# EAGLE design 1tm32_test (EAGLE 9.6.2)
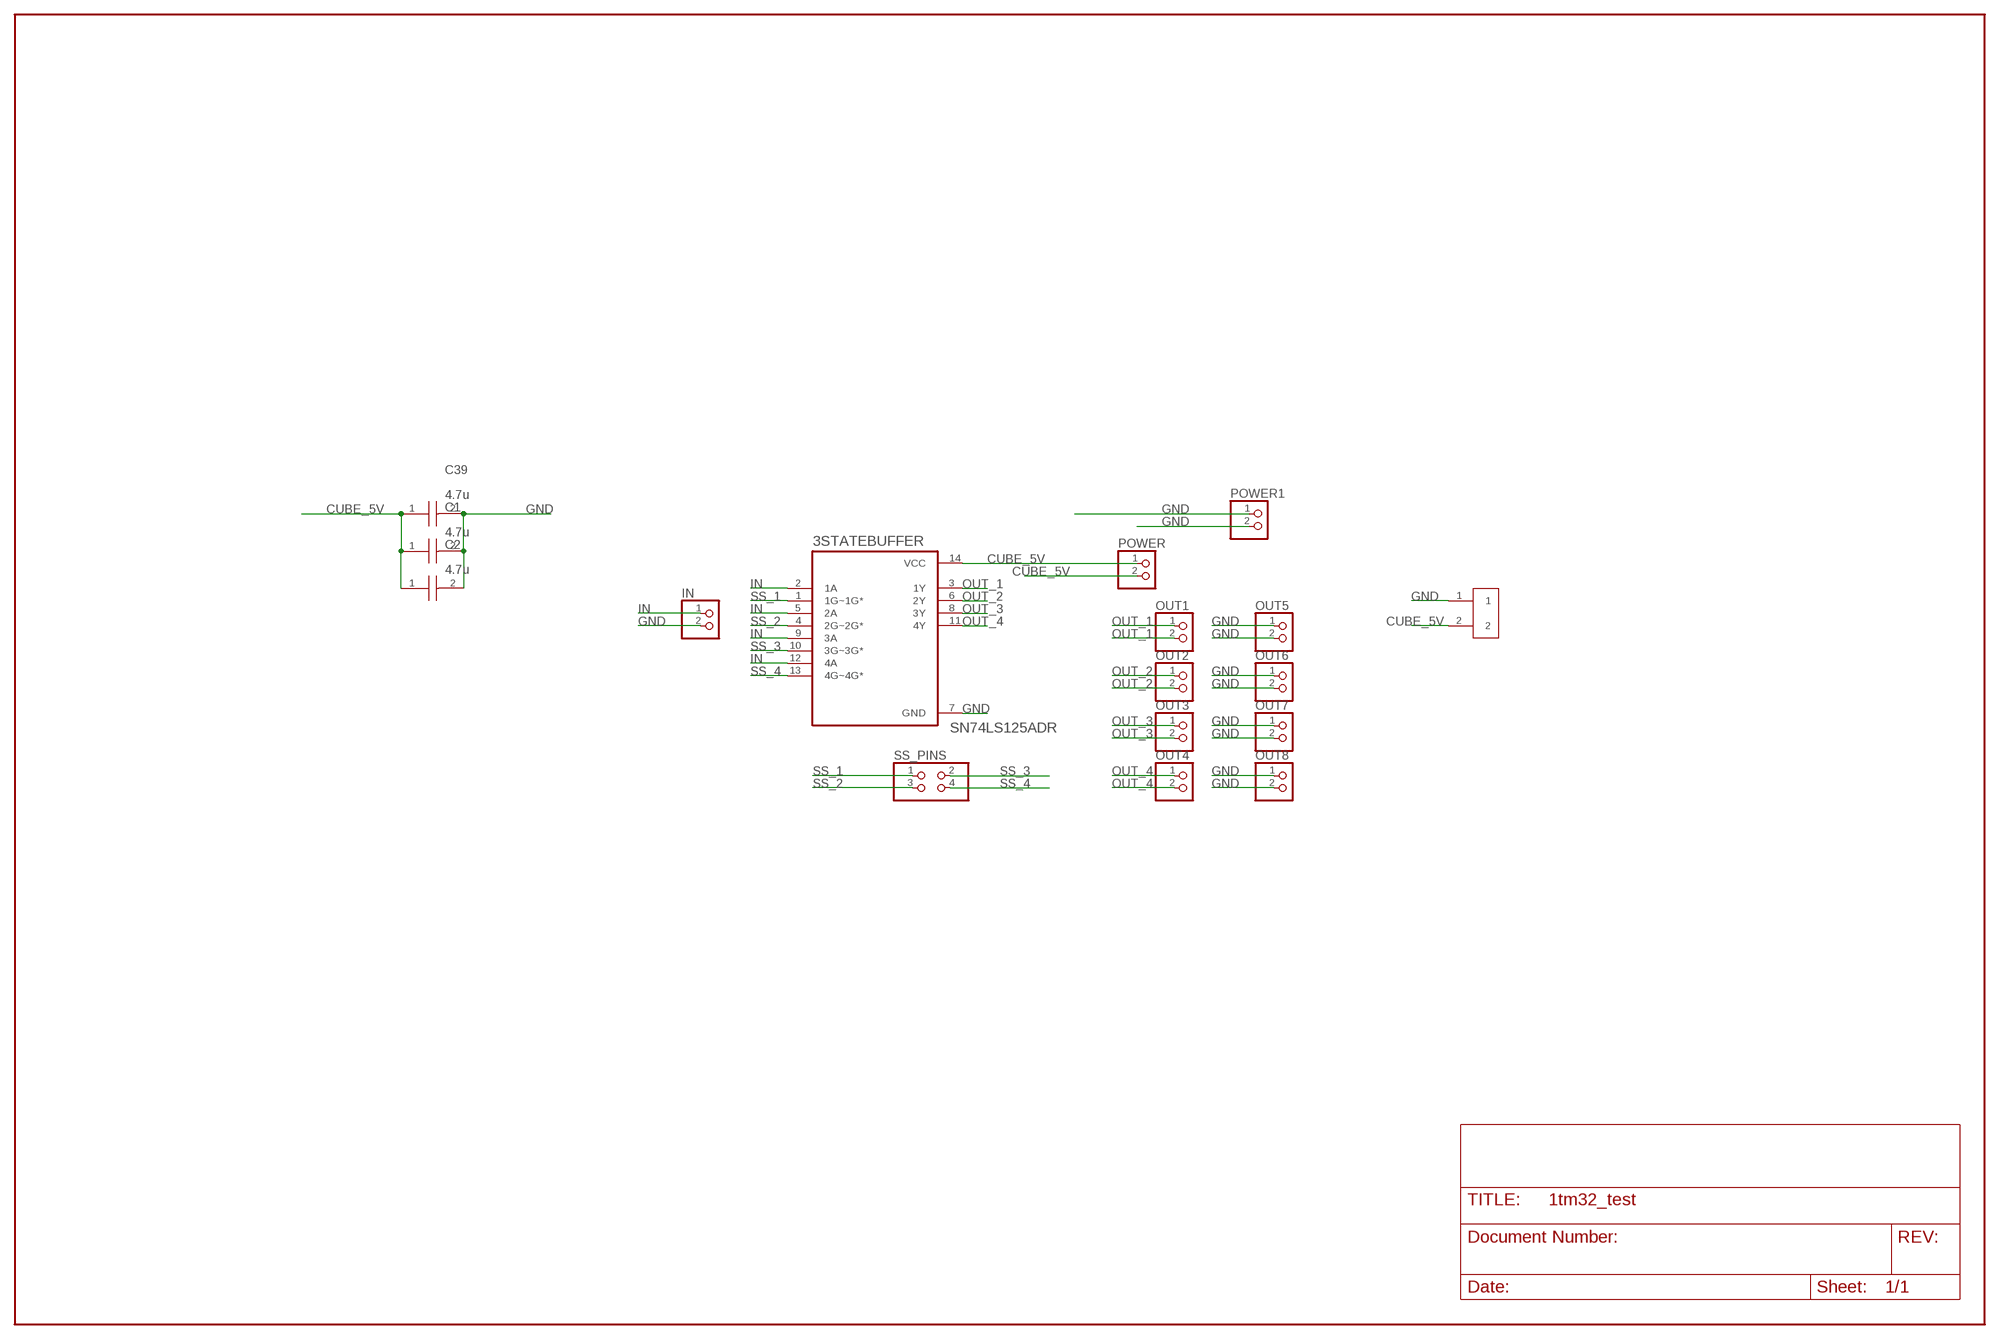
[diagram p0: schematic, sheet 1]

## Parts
3STATEBUFFER  SN74LS125ADR  [SOIC127P600X175-14N]
C1  4.7u  GRT21BC71H475KE13L  [CAPC2012X145N]
C2  4.7u  GRT21BC71H475KE13L  [CAPC2012X145N]
C39  4.7u  GRT21BC71H475KE13L  [CAPC2012X145N]
IN  PINHD-1X2  [1X02]
J1  1935161  [PHOENIX_1935161]
OUT1  PINHD-1X2  [1X02]
OUT2  PINHD-1X2  [1X02]
OUT3  PINHD-1X2  [1X02]
OUT4  PINHD-1X2  [1X02]
OUT5  PINHD-1X2  [1X02]
OUT6  PINHD-1X2  [1X02]
OUT7  PINHD-1X2  [1X02]
OUT8  PINHD-1X2  [1X02]
POWER  PINHD-1X2  [1X02]
POWER1  PINHD-1X2  [1X02]
SS_PINS  PINHD-2X2  [2X02]

## Nets
CUBE_5V: 3STATEBUFFER.14(VCC) C1.1 C2.1 C39.1 J1.2 POWER.1 POWER.2
GND: 3STATEBUFFER.7(GND) C1.2 C2.2 C39.2 IN.2 J1.1 OUT5.1 OUT5.2 OUT6.1 OUT6.2 OUT7.1 OUT7.2 OUT8.1 OUT8.2 POWER1.1 POWER1.2
IN: 3STATEBUFFER.2(1A) 3STATEBUFFER.5(2A) 3STATEBUFFER.9(3A) 3STATEBUFFER.12(4A) IN.1
OUT_1: 3STATEBUFFER.3(1Y) OUT1.1 OUT1.2
OUT_2: 3STATEBUFFER.6(2Y) OUT2.1 OUT2.2
OUT_3: 3STATEBUFFER.8(3Y) OUT3.1 OUT3.2
OUT_4: 3STATEBUFFER.11(4Y) OUT4.1 OUT4.2
SS_1: 3STATEBUFFER.1(1G~1G*) SS_PINS.1
SS_2: 3STATEBUFFER.4(2G~2G*) SS_PINS.3
SS_3: 3STATEBUFFER.10(3G~3G*) SS_PINS.2
SS_4: 3STATEBUFFER.13(4G~4G*) SS_PINS.4

## Library data of the parts
3STATEBUFFER = SN74LS125ADR:SN74LS125ADR: Check availability <https://pricing.snapeda.com/parts/SN74LS125ADR/Texas%20Instruments/view-part?ref=eda>; AVAILABILITY: In Stock; DESCRIPTION: 4-ch, 4.75-V to 5.25-V bipolar buffers with 3-state outputs; MF: Texas Instruments; MP: SN74LS125ADR; PACKAGE: SOIC-14 Texas Instruments; PRICE: None; PURCHASE-URL: https://pricing.snapeda.com/search/part/SN74LS125ADR/?ref=eda
C1 C2 C39 = GRT21BC71H475KE13L(4_7u):GRT21BC71H475KE13L: GRT21BC71H475KE13_ (0805, X7S:EIA, 4.7uF, DC50V) Source: Datasheet <https://search.murata.co.jp/Ceramy/image/img/A01X/G101/ENG/GRT21BC71H475KE13-01.pdf>; DESCRIPTION: GRT21BC71H475KE13_ (0805, X7S:EIA, 4.7uF, DC50V); HEIGHT: 1.45mm; MANUFACTURER_NAME: Murata Electronics; MANUFACTURER_PART_NUMBER: GRT21BC71H475KE13L; MOUSER_PART_NUMBER: 81-GRT21BC71H475KE3L; MOUSER_PRICE-STOCK: https://www.mouser.co.uk/ProductDetail/Murata-Electronics/GRT21BC71H475KE13L?qs=rI7uf1IzohQrtwc9u30k7A%3D%3D
IN OUT1-OUT8 POWER POWER1 = pinhead:PINHD-1X2: PIN HEADER
J1 = 1935161:1935161: Conn Terminal Blocks 2 POS 5mm Solder ST Thru-Hole 16A Check availability <https://pricing.snapeda.com/parts/1935161/Phoenix%20Contact/view-part?ref=eda>; AVAILABILITY: In Stock; DESCRIPTION: 2 Position Wire to Board Terminal Block Horizontal with Board 0.197 (5.00mm) Through Hole; MF: Phoenix Contact; MP: 1935161; PACKAGE: None; PRICE: None; PURCHASE-URL: https://pricing.snapeda.com/search/part/1935161/?ref=eda
SS_PINS = pinhead:PINHD-2X2: PIN HEADER

## Board
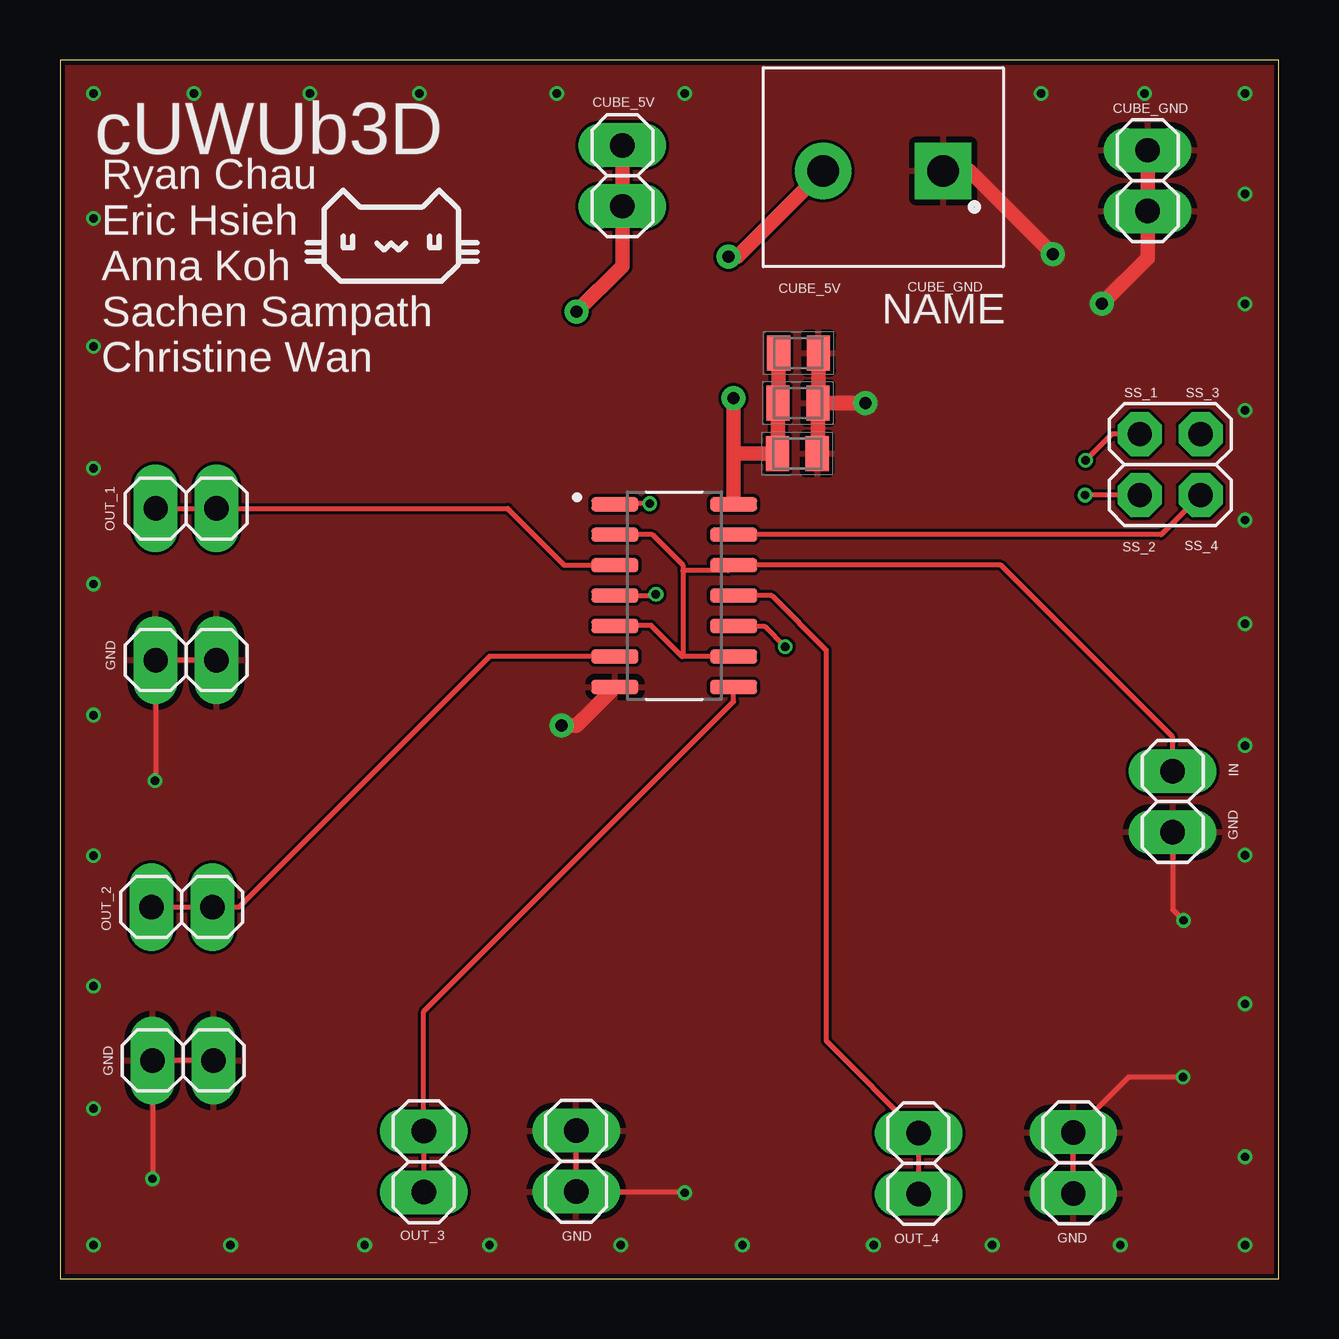
[diagram p1: board, top side]
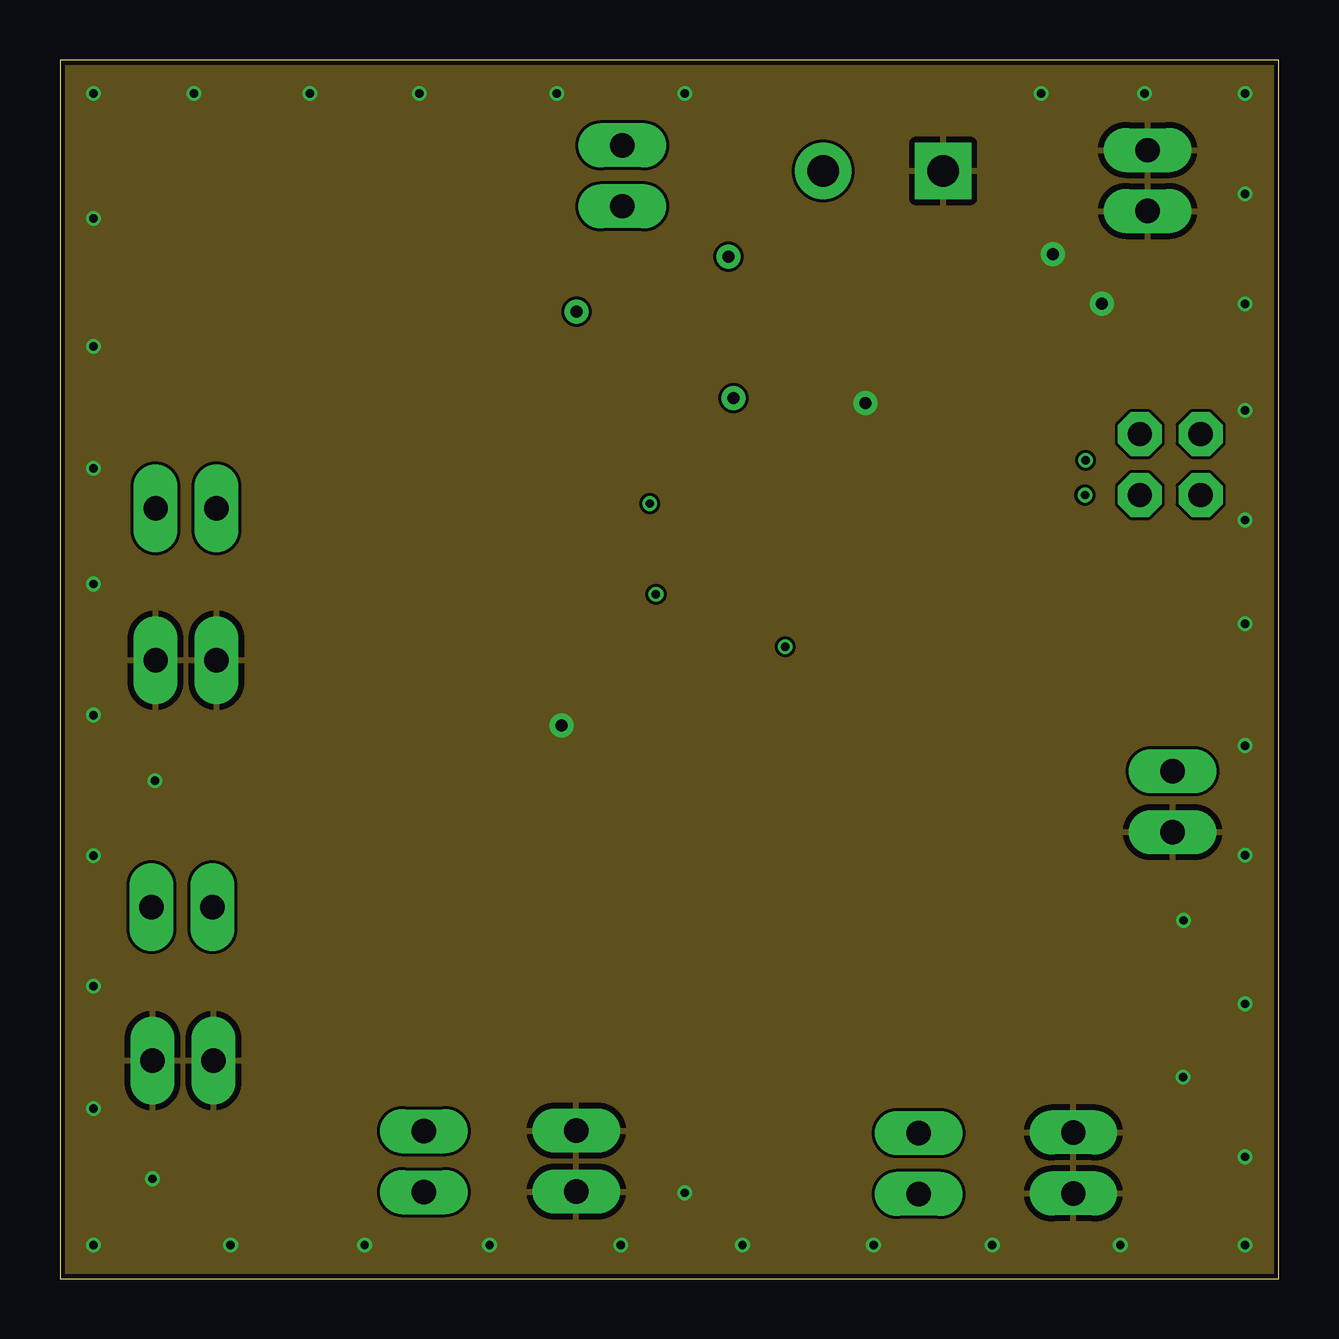
[diagram p2: board, inner layer Route2]
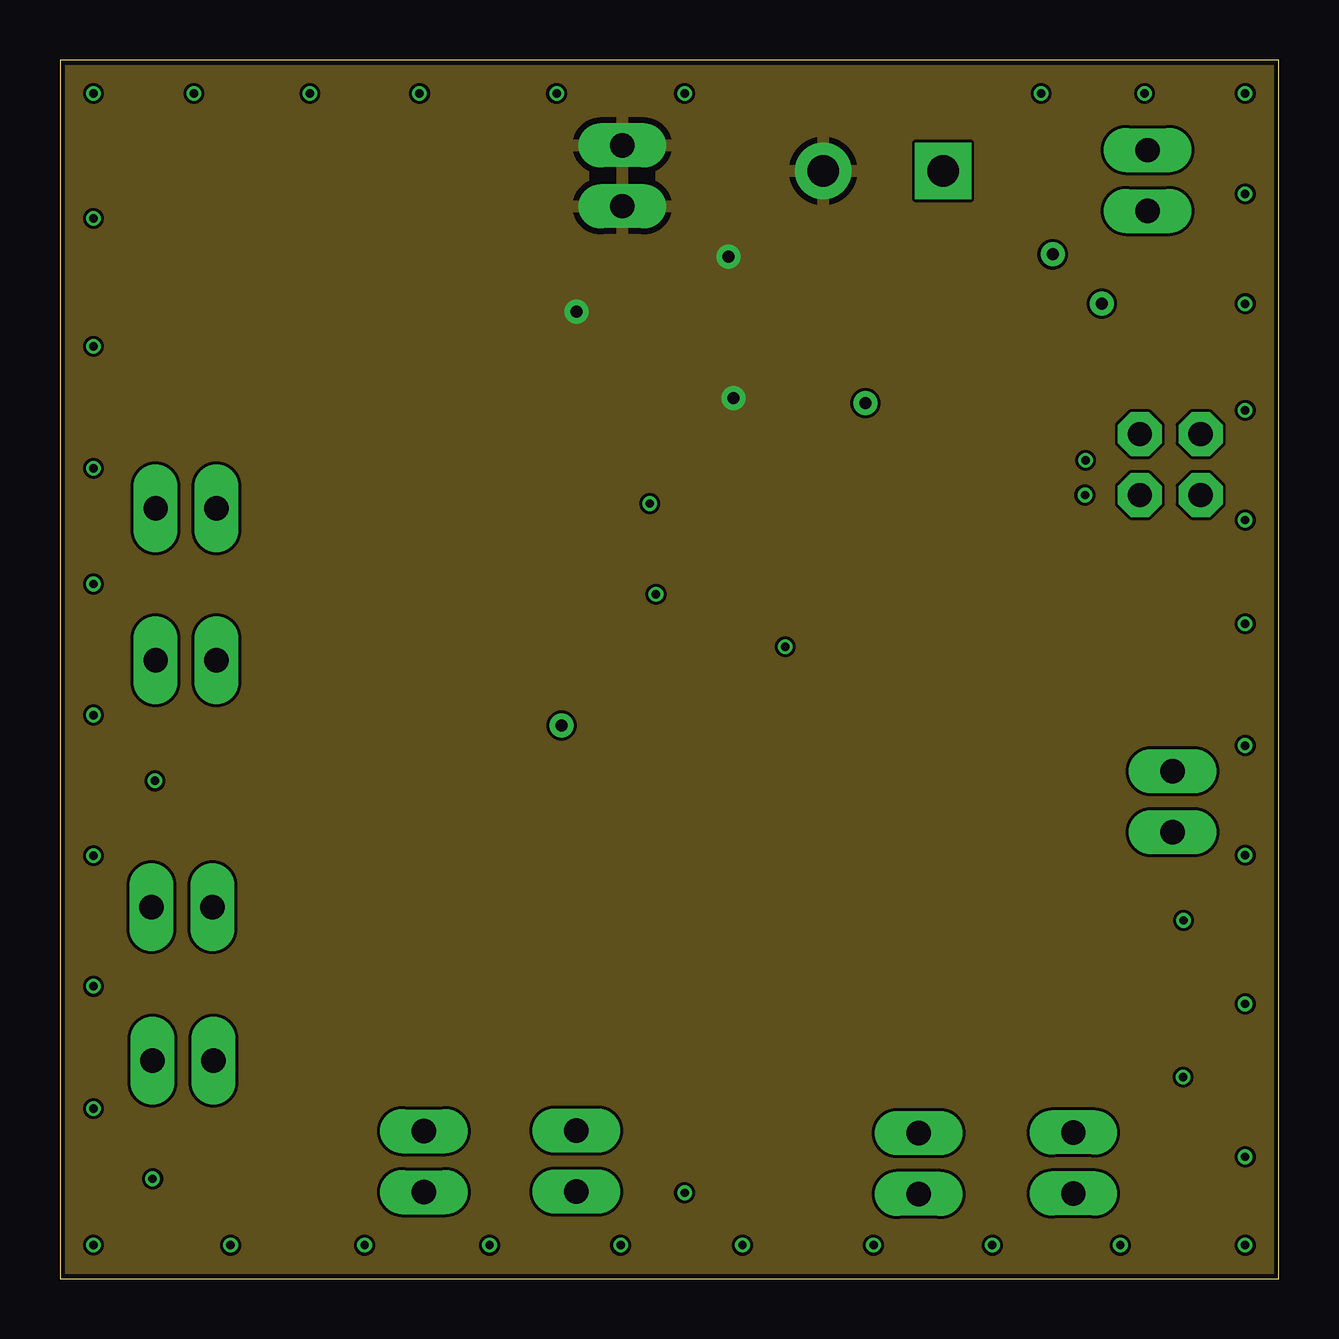
[diagram p3: board, inner layer Route15]
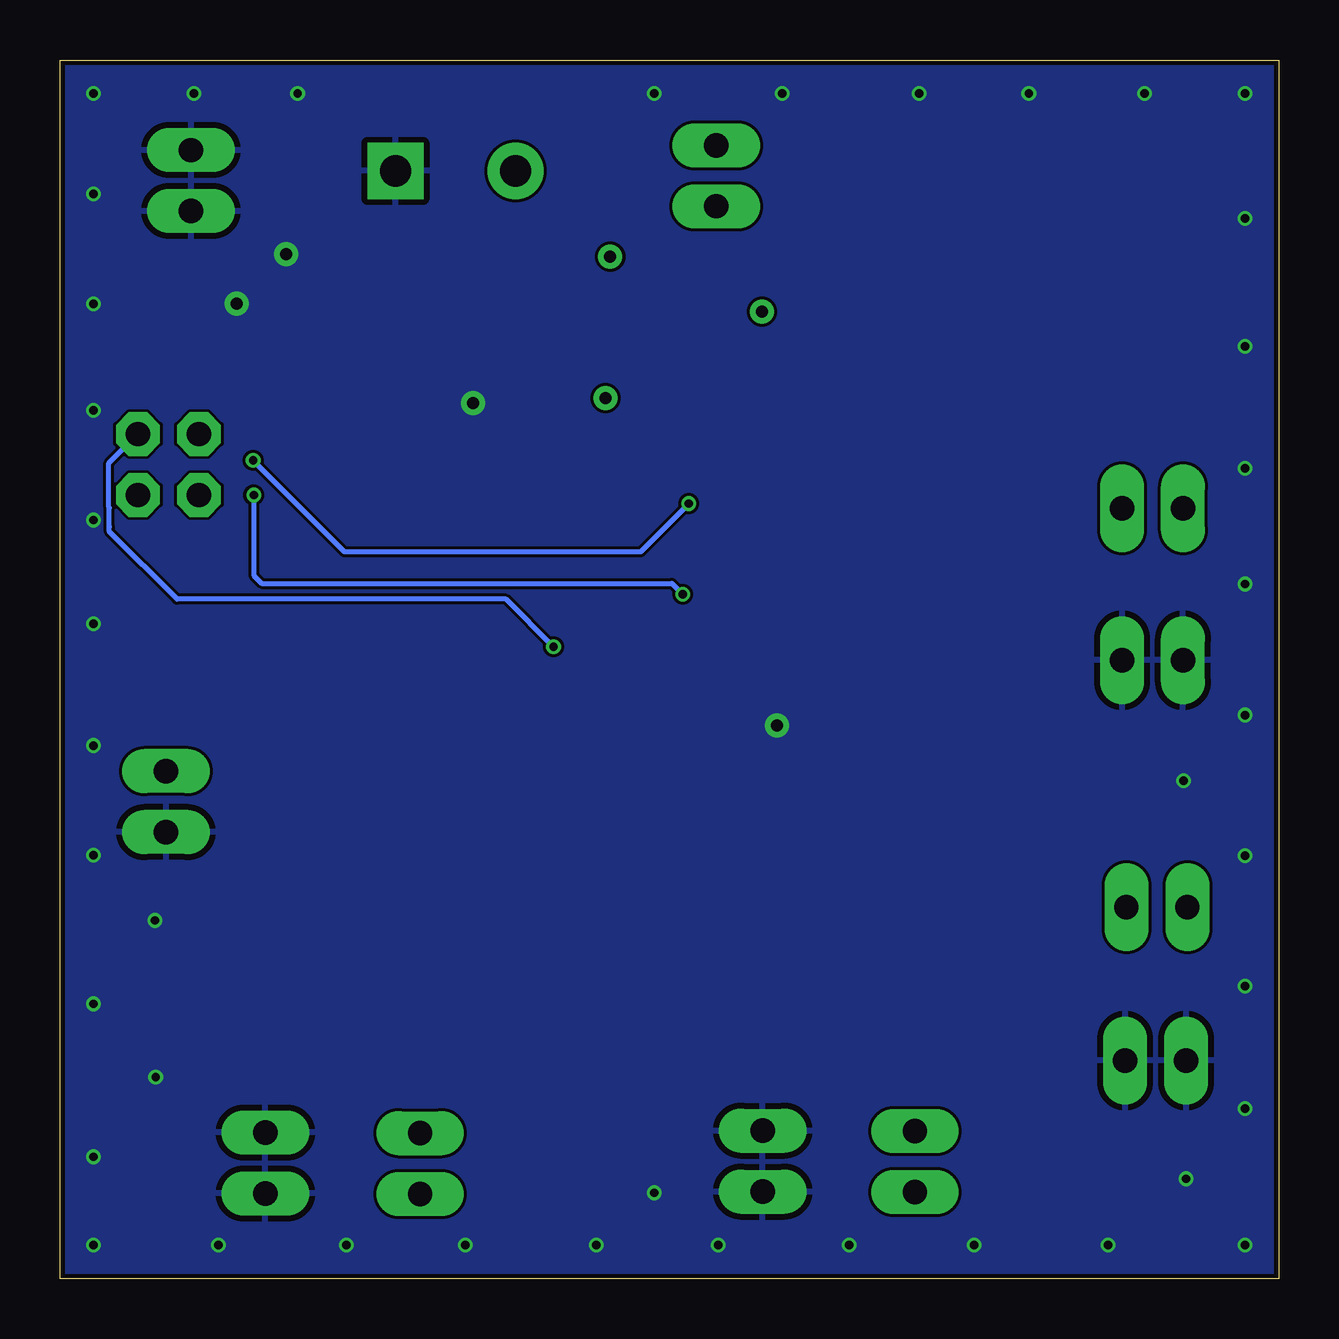
[diagram p4: board, bottom side, seen from below]

Size 50.8 x 50.8 mm. Coordinates in mm from the lower left corner, seen from the top.
Outline: 0,0 50.8,0 50.8,50.8 0,50.8 0,0
Copper layers (1+2*15+16): Top 0.035mm / dielectric 0.2mm / Route2 0.0175mm / dielectric 1.065mm / Route15 0.0175mm / dielectric 0.2mm / Bottom 0.035mm
Design rules "jlcpcb-4layers": minimum track width 3.5mil, minimum drill 0.2mm, track to track 5mil, track to pad 0.2mm, pad to pad 5mil, via to via 0.5mm, smd to smd 5mil, copper to edge 0.2mm, drill to drill 6mil, minimum pad ring 10mil, minimum via ring 0.13mm, stop-mask expansion 0.05mm, vias tented up to drill 16mil, thermal gap 10mil

### Footprints (pad centres in the part's own frame; a part is rotated, then mirrored left to right if it is on the bottom)
SOIC127P600X175-14N = smd 1.97 x 0.6: 1 -2.475,3.81; 2 -2.475,2.54; 3 -2.475,1.27; 4 -2.475,0; 5 -2.475,-1.27; 6 -2.475,-2.54; 7 -2.475,-3.81; 8 2.475,-3.81; 9 2.475,-2.54; 10 2.475,-1.27; 11 2.475,0; 12 2.475,1.27; 13 2.475,2.54; 14 2.475,3.81
CAPC2012X145N = smd 0.97 x 1.47: 1 -0.83,0; 2 0.83,0
1X02 = drill 1.016 long: 1 -1.27,0; 2 1.27,0
PHOENIX_1935161 = drill 1.3 square: 1 -2.5,0 | drill 1.3: 2 2.5,0
2X02 = drill 1.016 octagon: 1 -1.27,-1.27; 2 -1.27,1.27; 3 1.27,-1.27; 4 1.27,1.27

### Placement (x,y rotation side)
3STATEBUFFER  25.6,28.47 0 top
C1  30.76,36.5 0 top
C2  30.78,38.58 0 top
C39  30.73,34.39 0 top
IN  46.38,19.89 270 top
J1  34.32,46.18 180 top
OUT1  5.26,32.11 0 top
OUT2  5.08,15.49 180 top
OUT3  15.16,4.88 270 top
OUT4  35.79,4.8 90 top
OUT5  5.26,25.78 0 top
OUT6  5.13,9.09 0 top
OUT7  21.51,4.9 90 top
OUT8  42.24,4.83 90 top
POWER  23.44,45.97 90 top
POWER1  45.34,45.77 270 top
SS_PINS  46.28,33.93 270 top

### Tracks (layer width: path | path; a pad name or v marks a point on that pad's centre or on a via)
CUBE_5V  (via drill 0.5 pad 1)
  Top 0.61: POWER.2 POWER.1 23.44,42.22 v21.54,40.31 | v28.07,36.7 v28.08,36.69 28.08,34.39 | 28.08,34.39 3STATEBUFFER.14 | C2.1 29.95,36.52 C1.1 29.93,34.42 C39.1 28.08,34.39 | J1.2 28.23,42.6 v27.86,42.6
  pour Route15: -0.1,50.72 50.85,50.72 50.85,0.08 50.88,0.05 0.05,0.05 -0.05,-0.05 -0.05,50.67
GND  (via drill 0.35, 0.5 pad 1)
  Top 0.203: IN.2 46.38,15.39 v46.84,14.94 | OUT5.2 OUT5.1 3.99,20.78 v3.96,20.75 | OUT6.2 OUT6.1 v3.86,4.17 | OUT7.2 OUT7.1 25.98,3.63 v26.04,3.58 | OUT8.1 OUT8.2 44.55,8.41 v46.81,8.41
  Top 0.61: POWER1.1 POWER1.2 45.34,42.55 v43.43,40.64 | C2.2 31.61,36.52 C1.2 | C1.2 31.59,34.42 C39.2 | C1.2 v33.58,36.5 | 3STATEBUFFER.7 21.53,23.06 v20.9,23.06 | J1.1 37.9,46.18 v41.38,42.7
  other vias: 1.4,1.4 7.11,1.4 12.7,1.4 17.91,1.4 23.37,1.4 28.45,1.4 33.91,1.4 38.86,1.4 44.2,1.4 49.4,1.4 49.4,5.08 49.4,17.65 49.4,22.23 49.4,27.3 49.4,31.62 49.4,36.2 49.4,40.64 49.4,45.21 49.4,49.4 45.21,49.4 40.89,49.4 14.99,49.4 10.41,49.4 5.59,49.4 1.4,49.4 1.4,44.2 1.4,38.86 1.4,33.78 1.4,28.96 1.4,23.5 1.4,17.64 1.4,12.19 1.4,7.09 20.7,49.4 26.04,49.4 49.4,11.46
  pour Top: 0,50.8 50.8,50.8 50.8,0 0,0
  pour Bottom: 0,50.8 20.9,50.8 30,50.8 50.8,50.8 50.8,0 0,0
  pour Route2: 0,50.8 50.77,50.8 50.77,0 0,0
IN
  Top 0.203: IN.1 46.38,22.58 39.22,29.74 3STATEBUFFER.12 27.85,29.52 25.96,29.52 | 3STATEBUFFER.2 24.69,31.01 25.96,29.74 25.96,29.52 | 3STATEBUFFER.9 25.93,25.93 | 25.93,25.93 24.64,27.23 23.15,27.23 3STATEBUFFER.5 | 25.96,29.52 25.96,25.96 25.93,25.93
OUT_1
  Top 0.203: 3STATEBUFFER.3 21.02,29.74 18.66,32.11 OUT1.2 OUT1.1
OUT_2
  Top 0.203: 3STATEBUFFER.6 23.11,25.95 17.92,25.95 7.47,15.49 OUT2.1 OUT2.2
OUT_3
  Top 0.203: 3STATEBUFFER.8 28.08,24.06 15.16,11.14 OUT3.1 OUT3.2
OUT_4
  Top 0.203: 3STATEBUFFER.11 29.67,28.47 31.93,26.21 31.93,9.93 OUT4.2 OUT4.1
SS_1  (via drill 0.35)
  Top 0.203: SS_PINS.1 43.84,35.2 v42.75,34.11 | v24.59,32.31 23.15,32.31 3STATEBUFFER.1
  Bottom 0.203: v42.75,34.11 38.95,30.31 26.59,30.31 v24.59,32.31
SS_2  (via drill 0.35)
  Top 0.203: SS_PINS.3 v42.72,32.66 | v24.84,28.52 24.79,28.47 3STATEBUFFER.4
  Bottom 0.203: v24.84,28.52 25.3,28.98 42.39,28.98 42.72,29.31 v42.72,32.66
SS_3  (via drill 0.35)
  Top 0.203: 3STATEBUFFER.10 29.36,27.2 v30.23,26.34
  Bottom 0.203: v30.23,26.34 32.21,28.32 45.92,28.32 48.74,31.14 48.74,31.35 48.74,32.14 48.77,32.16 48.77,33.99 SS_PINS.2
SS_4
  Top 0.203: 3STATEBUFFER.13 45.9,31.01 SS_PINS.4

### Text on the board
tPlace: CUBE_5V | CUBE_GND | cUWUb3D | CUBE_5V | CUBE_GND | Ryan Chau / Eric Hsieh / Anna Koh / Sachen Sampath / Christine Wan | SS_1 | SS_3 | OUT_1 | SS_2 | SS_4 | GND | IN | GND | OUT_2 | GND | OUT_3 | GND | OUT_4 | GND